# Altium schematic sheet BTS7960.SchDoc
size 420 x 297 mm; SheetNumber: 3; SheetTotal: 4; Organization: Altium Limited; Address1: L3, 12a Rodborough Rd; Address2: Frenchs Forest; Address3: NSW; Address4: Australia 2086
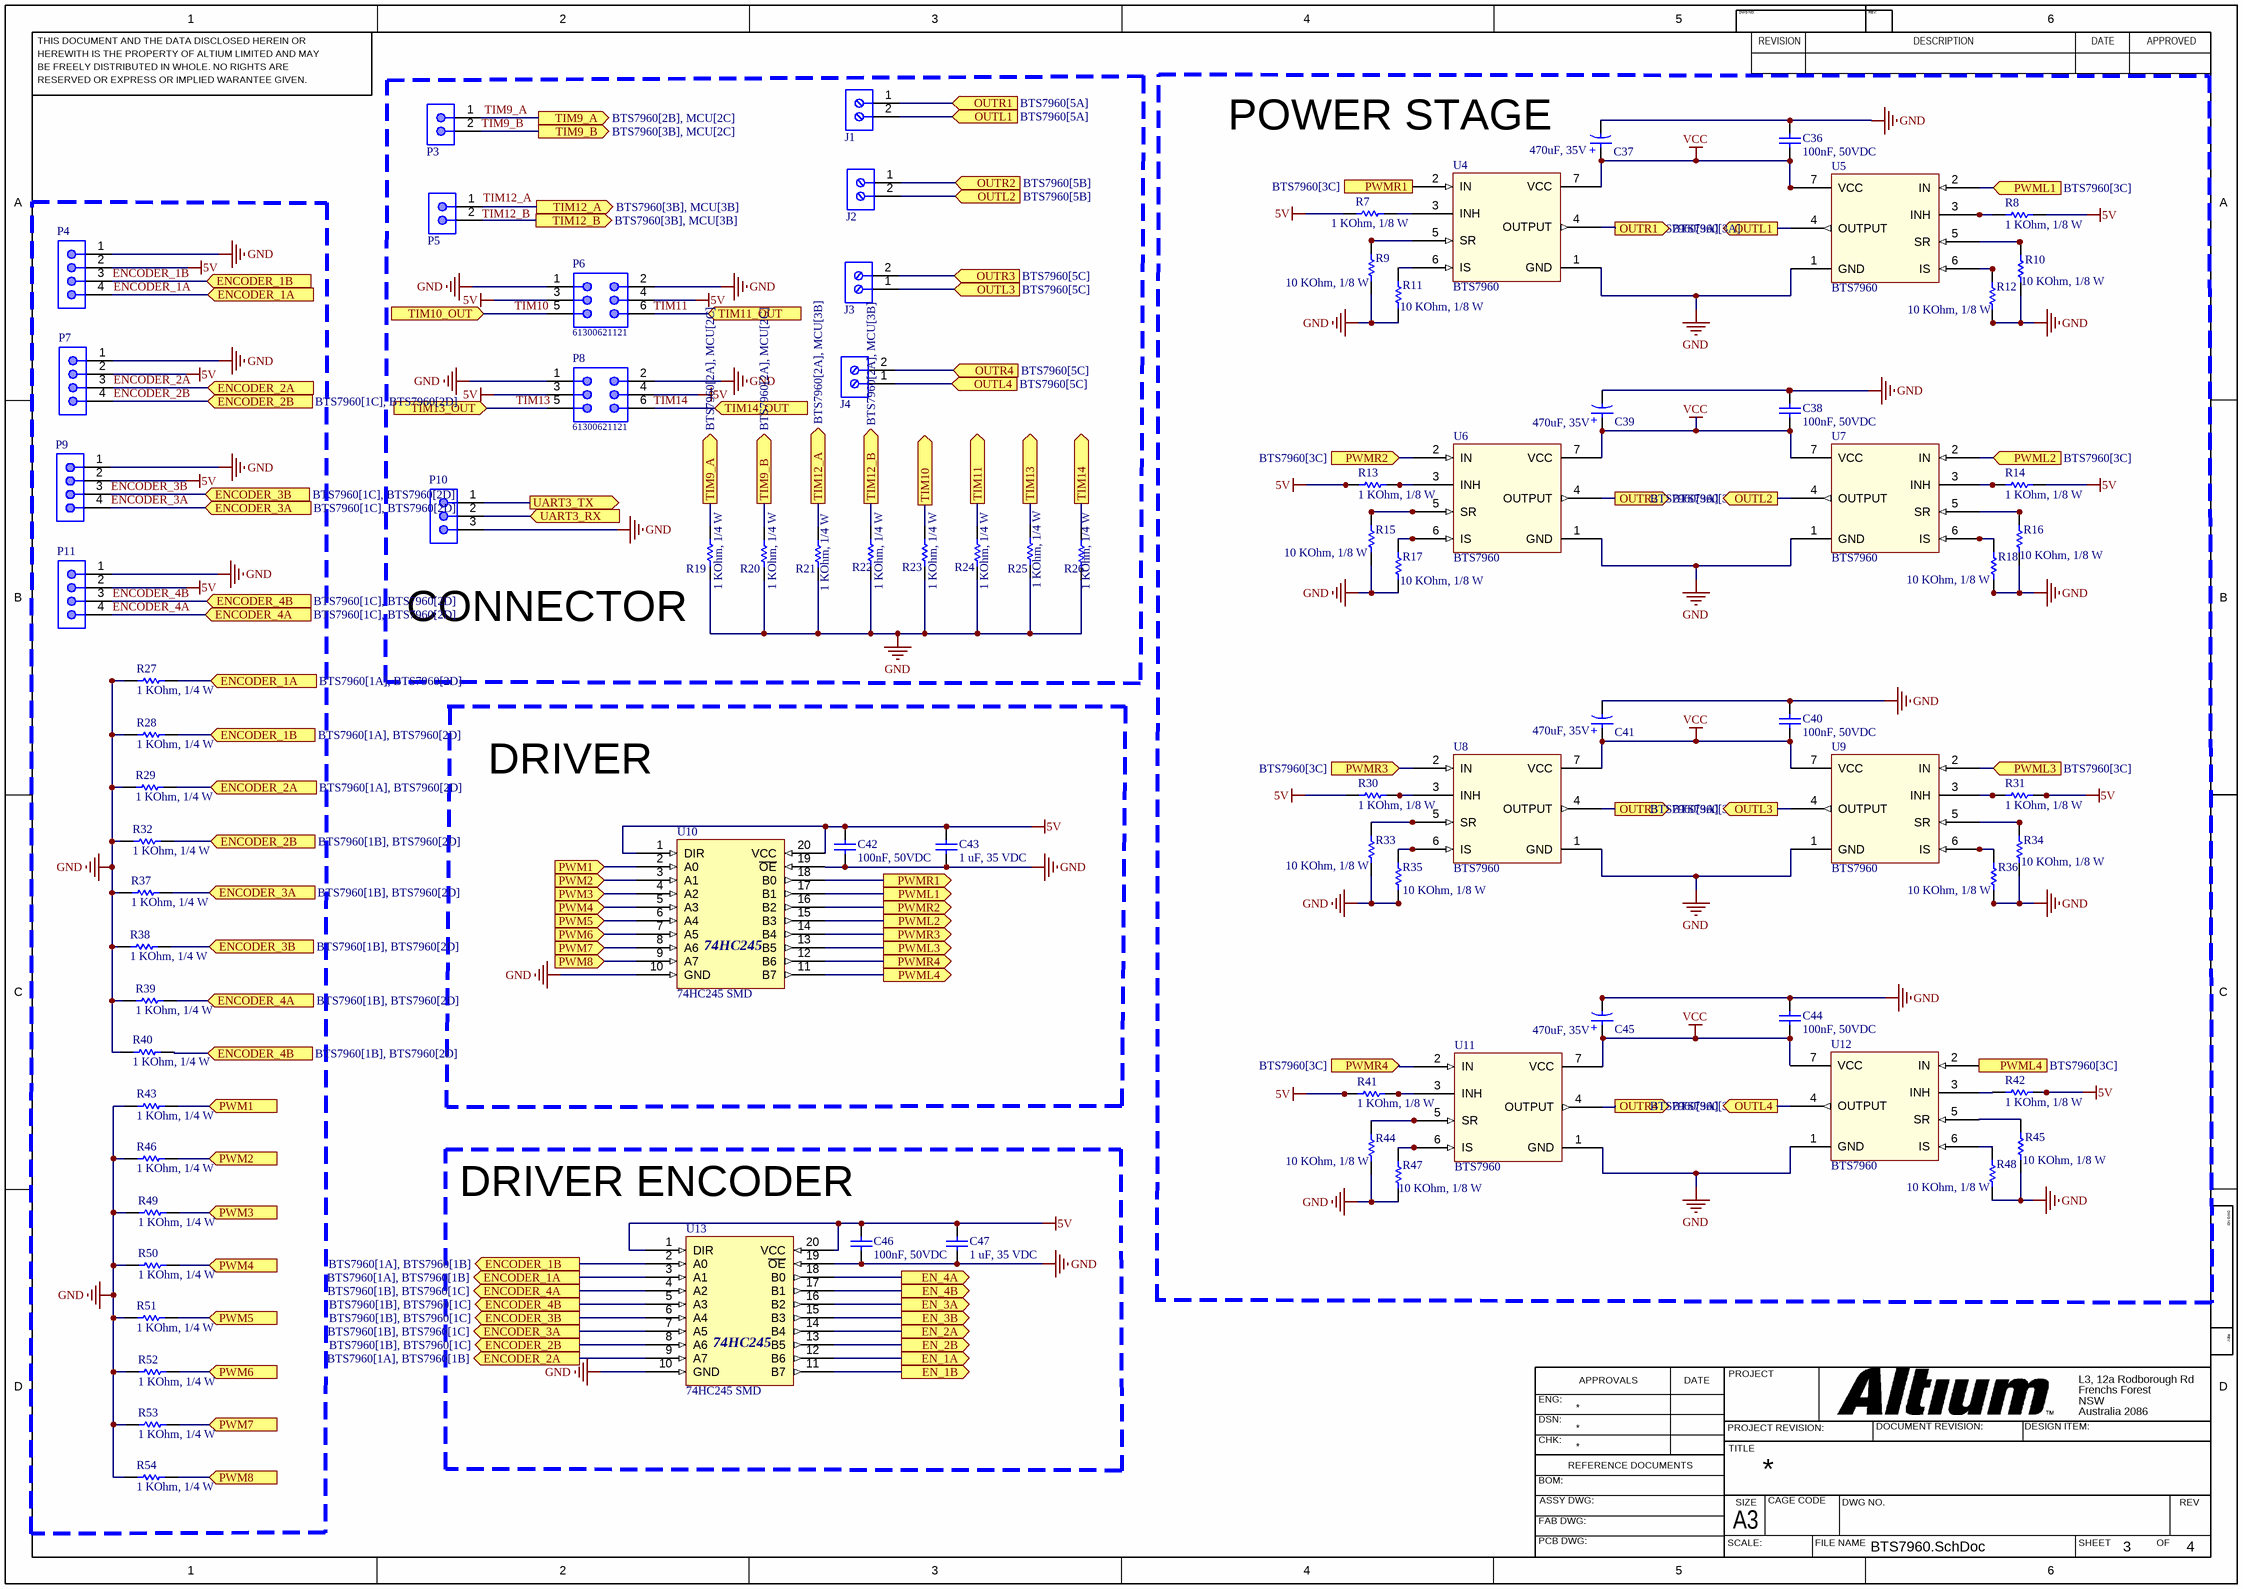
[diagram p0: BTS7960.SchDoc]

## Parts
C36  100nF, 50VDC  [CAP_0805]
C37  470uF, 35V  [WCAP-ASLI_D10H10.5]
C38  100nF, 50VDC  [CAP_0805]
C39  470uF, 35V  [WCAP-ASLI_D10H10.5]
C40  100nF, 50VDC  [CAP_0805]
C41  470uF, 35V  [WCAP-ASLI_D10H10.5]
C42  100nF, 50VDC  [CAP_0805]
C43  1 uF, 35 VDC  [CAP_0805]
C44  100nF, 50VDC  [CAP_0805]
C45  470uF, 35V  [WCAP-ASLI_D10H10.5]
C46  100nF, 50VDC  [CAP_0805]
C47  1 uF, 35 VDC  [CAP_0805]
J1  16A, 300V  [691213710002]  (value not drawn)
J2  16A, 300V  [691213710002]  (value not drawn)
J3  16A, 300V  [691213710002]  (value not drawn)
J4  16A, 300V  [691213710002]  (value not drawn)
P3  2A, 125V(AC)  [62000211622]  (value not drawn)
P4  1A, 50 V (AC)  [64800411622]  (value not drawn)
P5  2A, 125V(AC)  [62000211622]  (value not drawn)
P6  61300621121  [61300621121]
P7  1A, 50 V (AC)  [64800411622]  (value not drawn)
P8  61300621121  [61300621121]
P9  1A, 50 V (AC)  [64800411622]  (value not drawn)
P10  2A, 125V(AC)  [62000311622]  (value not drawn)
P11  1A, 50 V (AC)  [64800411622]  (value not drawn)
R7  1 KOhm, 1/8 W  [RESISTOR_0805]
R8  1 KOhm, 1/8 W  [RESISTOR_0805]
R9  10 KOhm, 1/8 W  [RESISTOR_0805]
R10  10 KOhm, 1/8 W  [RESISTOR_0805]
R11  10 KOhm, 1/8 W  [RESISTOR_0805]
R12  10 KOhm, 1/8 W  [RESISTOR_0805]
R13  1 KOhm, 1/8 W  [RESISTOR_0805]
R14  1 KOhm, 1/8 W  [RESISTOR_0805]
R15  10 KOhm, 1/8 W  [RESISTOR_0805]
R16  10 KOhm, 1/8 W  [RESISTOR_0805]
R17  10 KOhm, 1/8 W  [RESISTOR_0805]
R18  10 KOhm, 1/8 W  [RESISTOR_0805]
R19  1 KOhm, 1/4 W  [resistor_0603]
R20  1 KOhm, 1/4 W  [resistor_0603]
R21  1 KOhm, 1/4 W  [resistor_0603]
R22  1 KOhm, 1/4 W  [resistor_0603]
R23  1 KOhm, 1/4 W  [resistor_0603]
R24  1 KOhm, 1/4 W  [resistor_0603]
R25  1 KOhm, 1/4 W  [resistor_0603]
R26  1 KOhm, 1/4 W  [resistor_0603]
R27  1 KOhm, 1/4 W  [resistor_0603]
R28  1 KOhm, 1/4 W  [resistor_0603]
R29  1 KOhm, 1/4 W  [resistor_0603]
R30  1 KOhm, 1/8 W  [RESISTOR_0805]
R31  1 KOhm, 1/8 W  [RESISTOR_0805]
R32  1 KOhm, 1/4 W  [resistor_0603]
R33  10 KOhm, 1/8 W  [RESISTOR_0805]
R34  10 KOhm, 1/8 W  [RESISTOR_0805]
R35  10 KOhm, 1/8 W  [RESISTOR_0805]
R36  10 KOhm, 1/8 W  [RESISTOR_0805]
R37  1 KOhm, 1/4 W  [resistor_0603]
R38  1 KOhm, 1/4 W  [resistor_0603]
R39  1 KOhm, 1/4 W  [resistor_0603]
R40  1 KOhm, 1/4 W  [resistor_0603]
R41  1 KOhm, 1/8 W  [RESISTOR_0805]
R42  1 KOhm, 1/8 W  [RESISTOR_0805]
R43  1 KOhm, 1/4 W  [resistor_0603]
R44  10 KOhm, 1/8 W  [RESISTOR_0805]
R45  10 KOhm, 1/8 W  [RESISTOR_0805]
R46  1 KOhm, 1/4 W  [resistor_0603]
R47  10 KOhm, 1/8 W  [RESISTOR_0805]
R48  10 KOhm, 1/8 W  [RESISTOR_0805]
R49  1 KOhm, 1/4 W  [resistor_0603]
R50  1 KOhm, 1/4 W  [resistor_0603]
R51  1 KOhm, 1/4 W  [resistor_0603]
R52  1 KOhm, 1/4 W  [resistor_0603]
R53  1 KOhm, 1/4 W  [resistor_0603]
R54  1 KOhm, 1/4 W  [resistor_0603]
U4  BTS7960  [INF-P-TO-263-7-6_M]
U5  BTS7960  [INF-P-TO-263-7-6_M]
U6  BTS7960  [INF-P-TO-263-7-6_M]
U7  BTS7960  [INF-P-TO-263-7-6_M]
U8  BTS7960  [INF-P-TO-263-7-6_M]
U9  BTS7960  [INF-P-TO-263-7-6_M]
U10  74HC245 SMD  [DW0020A_L]
U11  BTS7960  [INF-P-TO-263-7-6_M]
U12  BTS7960  [INF-P-TO-263-7-6_M]
U13  74HC245 SMD  [DW0020A_L]

## Blocks framed on the sheet
CONNECTOR: J1-J4 P3 P5 P6 P8 P10 R19-R26
POWER STAGE: C36-C41 C44 C45 R7-R18 R30 R31 R33-R36 R41 R42 R44 R45 R47 R48 U4-U9 U11 U12
DRIVER ENCODER: C46 C47 U13

## Ports
EN_1A (out, see MCU[2C]), EN_1B (out, see MCU[2C]), EN_2A (out, see MCU[3A]), EN_2B (out, see MCU[3A]), EN_3A (out, see MCU[2A]), EN_3B (out, see MCU[3A]), EN_4A (out, see MCU[2A]), EN_4B (out, see MCU[2A]), ENCODER_1A (in, see BTS7960[1A], BTS7960[2D]), ENCODER_1A (in, see BTS7960[1B], BTS7960[2D]), ENCODER_1A (out, see BTS7960[1A], BTS7960[1B]), ENCODER_1B (in, see BTS7960[1A], BTS7960[2D]), ENCODER_1B (in, see BTS7960[1B], BTS7960[2D]), ENCODER_1B (out, see BTS7960[1A], BTS7960[1B]), ENCODER_2A (in, see BTS7960[1A], BTS7960[2D]), ENCODER_2A (in, see BTS7960[1B], BTS7960[2D]), ENCODER_2A (out, see BTS7960[1A], BTS7960[1B]), ENCODER_2B (in, see BTS7960[1B], BTS7960[2D]), ENCODER_2B (in, see BTS7960[1C], BTS7960[2D]), ENCODER_2B (out, see BTS7960[1B], BTS7960[1C]), ENCODER_3A (in, see BTS7960[1B], BTS7960[2D]), ENCODER_3A (in, see BTS7960[1C], BTS7960[2D]), ENCODER_3A (out, see BTS7960[1B], BTS7960[1C]), ENCODER_3B (in, see BTS7960[1B], BTS7960[2D]), ENCODER_3B (in, see BTS7960[1C], BTS7960[2D]), ENCODER_3B (out, see BTS7960[1B], BTS7960[1C]), ENCODER_4A (in, see BTS7960[1B], BTS7960[2D]), ENCODER_4A (in, see BTS7960[1C], BTS7960[2D]), ENCODER_4A (out, see BTS7960[1B], BTS7960[1C]), ENCODER_4B (in, see BTS7960[1B], BTS7960[2D]), ENCODER_4B (in, see BTS7960[1C], BTS7960[2D]), ENCODER_4B (out, see BTS7960[1B], BTS7960[1C]), OUTL1 (in, see BTS7960[5A]), OUTL1 (out, see BTS7960[3A]), OUTL2 (in, see BTS7960[5B]), OUTL2 (out, see BTS7960[3A]), OUTL3 (in, see BTS7960[5C]), OUTL3 (out, see BTS7960[3A]), OUTL4 (in, see BTS7960[5C]), OUTL4 (out, see BTS7960[3A]), OUTR1 (in, see BTS7960[5A]), OUTR1 (out, see BTS7960[3A]), OUTR2 (in, see BTS7960[5B]), OUTR2 (out, see BTS7960[3A]), OUTR3 (in, see BTS7960[5C]), OUTR3 (out, see BTS7960[3A]), OUTR4 (in, see BTS7960[5C]), OUTR4 (out, see BTS7960[3A]), PWM1 (in, see BTS7960[1C], MCU[2B]), PWM1 (in, see BTS7960[2C], MCU[2B]), PWM2 (in, see BTS7960[1C], MCU[2B]), PWM2 (in, see BTS7960[2C], MCU[2B]), PWM3 (in, see BTS7960[1D], MCU[2B]), PWM3 (in, see BTS7960[2C], MCU[2B]), PWM4 (in, see BTS7960[1D], MCU[2B]), PWM4 (in, see BTS7960[2C], MCU[2B]), PWM5 (in, see BTS7960[1D], MCU[3B]), PWM5 (in, see BTS7960[2C], MCU[3B]), PWM6 (in, see BTS7960[1D], MCU[3B]), PWM6 (in, see BTS7960[2C], MCU[3B]), PWM7 (in, see BTS7960[1D], MCU[3B]), PWM7 (in, see BTS7960[2C], MCU[3B]), PWM8 (in, see BTS7960[1D], MCU[3B]), PWM8 (in, see BTS7960[2C], MCU[3B]), PWML1 (in, see BTS7960[3C]), PWML1 (out, see BTS7960[6A]), PWML2 (in, see BTS7960[3C]), PWML2 (out, see BTS7960[6B]), PWML3 (in, see BTS7960[3C]), PWML3 (out, see BTS7960[6B]), PWML4 (in, see BTS7960[3C]), PWML4 (out, see BTS7960[6C]), PWMR1 (in, see BTS7960[3C]), PWMR1 (out, see BTS7960[4A]), PWMR2 (in, see BTS7960[3C]), PWMR2 (out, see BTS7960[4B]), PWMR3 (in, see BTS7960[3C]), PWMR3 (out, see BTS7960[4B]), PWMR4 (in, see BTS7960[3C]), PWMR4 (out, see BTS7960[4C]), TIM9_A (out, see BTS7960[2A], MCU[2C]), TIM9_A (out, see BTS7960[2B], MCU[2C]), TIM9_B (out, see BTS7960[2A], MCU[2C]), TIM9_B (out, see BTS7960[3B], MCU[2C]), TIM10 (out, see Controller[4C], MCU[3B]), TIM10_OUT (in, see Controller[5C]), TIM11 (out, see Controller[5C], MCU[3B]), TIM11_OUT (in, see Controller[6C]), TIM12_A (out, see BTS7960[2A], MCU[3B]), TIM12_A (out, see BTS7960[3B], MCU[3B]), TIM12_B (out, see BTS7960[2A], MCU[3B]), TIM12_B (out, see BTS7960[3B], MCU[3B]), TIM13 (out, see Controller[4C], MCU[2B]), TIM13_OUT (in, see Controller[5C]), TIM14 (out, see Controller[5C], MCU[2B]), TIM14_OUT (in, see Controller[6C]), UART3_RX (in, see MCU[3B]), UART3_TX (out, see MCU[3B])

## Nets
5V: C42.2 C43.2 C46.2 C47.2 P4.2 P6.3 P6.4 P7.2 P8.3 P8.4 P9.2 P11.2 R7.1 R8.2 R13.1 R14.2 R30.1 R31.2 R41.1 R42.2 U10.1(DIR) U10.20(VCC) U13.1(DIR) U13.20(VCC)
GND: C36.2 C37.2(N) C38.2 C39.2(N) C40.2 C41.2(N) C42.1 C43.1 C44.2 C45.2(N) C46.1 C47.1 P4.1 P6.1 P6.2 P7.1 P8.1 P8.2 P9.1 P10.3 P11.1 R9.1 R10.1 R11.1 R12.1 R15.1 R16.1 R17.1 R18.1 R19.1 R20.1 R21.1 R22.1 R23.1 R24.1 R25.1 R26.1 R27.2 R28.2 R29.2 R32.2 R33.1 R34.1 R35.1 R36.1 R37.2 R38.2 R39.2 R40.2 R43.2 R44.1 R45.1 R46.2 R47.1 R48.1 R49.2 R50.2 R51.2 R52.2 R53.2 R54.2 U4.1(GND) U5.1(GND) U6.1(GND) U7.1(GND) U8.1(GND) U9.1(GND) U10.10(GND) U10.19(~{OE}) U11.1(GND) U12.1(GND) U13.10(GND) U13.19(~{OE})
VCC: C36.1 C37.1(P) C38.1 C39.1(P) C40.1 C41.1(P) C44.1 C45.1(P) U4.7(VCC) U5.7(VCC) U6.7(VCC) U7.7(VCC) U8.7(VCC) U9.7(VCC) U11.7(VCC) U12.7(VCC)
EN_1A: U13.12(B6) ; port EN_1A
EN_1B: U13.11(B7) ; port EN_1B
EN_2A: U13.14(B4) ; port EN_2A
EN_2B: U13.13(B5) ; port EN_2B
EN_3A: U13.16(B2) ; port EN_3A
EN_3B: U13.15(B3) ; port EN_3B
EN_4A: U13.18(B0) ; port EN_4A
EN_4B: U13.17(B1) ; port EN_4B
ENCODER_1A: P4.4 R27.1 U13.3(A1) ; port ENCODER_1A
ENCODER_1B: P4.3 R28.1 U13.2(A0) ; port ENCODER_1B
ENCODER_2A: P7.3 R29.1 U13.9(A7) ; port ENCODER_2A
ENCODER_2B: P7.4 R32.1 U13.8(A6) ; port ENCODER_2B
ENCODER_3A: P9.4 R37.1 U13.7(A5) ; port ENCODER_3A
ENCODER_3B: P9.3 R38.1 U13.6(A4) ; port ENCODER_3B
ENCODER_4A: P11.4 R39.1 U13.4(A2) ; port ENCODER_4A
ENCODER_4B: P11.3 R40.1 U13.5(A3) ; port ENCODER_4B
OUTL1: J1.2 U5.4(OUTPUT) ; port OUTL1
OUTL2: J2.2 U7.4(OUTPUT) ; port OUTL2
OUTL3: J3.1 U9.4(OUTPUT) ; port OUTL3
OUTL4: J4.1 U12.4(OUTPUT) ; port OUTL4
OUTR1: J1.1 U4.4(OUTPUT) ; port OUTR1
OUTR2: J2.1 U6.4(OUTPUT) ; port OUTR2
OUTR3: J3.2 U8.4(OUTPUT) ; port OUTR3
OUTR4: J4.2 U11.4(OUTPUT) ; port OUTR4
PWM1: R43.1 U10.2(A0) ; port PWM1
PWM2: R46.1 U10.3(A1) ; port PWM2
PWM3: R49.1 U10.4(A2) ; port PWM3
PWM4: R50.1 U10.5(A3) ; port PWM4
PWM5: R51.1 U10.6(A4) ; port PWM5
PWM6: R52.1 U10.7(A5) ; port PWM6
PWM7: R53.1 U10.8(A6) ; port PWM7
PWM8: R54.1 U10.9(A7) ; port PWM8
PWML1: U5.2(IN) U10.17(B1) ; port PWML1
PWML2: U7.2(IN) U10.15(B3) ; port PWML2
PWML3: U9.2(IN) U10.13(B5) ; port PWML3
PWML4: U10.11(B7) U12.2(IN) ; port PWML4
PWMR1: U4.2(IN) U10.18(B0) ; port PWMR1
PWMR2: U6.2(IN) U10.16(B2) ; port PWMR2
PWMR3: U8.2(IN) U10.14(B4) ; port PWMR3
PWMR4: U10.12(B6) U11.2(IN) ; port PWMR4
TIM9_A: P3.1 R19.2 ; port TIM9_A
TIM9_B: P3.2 R20.2 ; port TIM9_B
TIM10: P6.5 ; port TIM10_OUT
TIM10: R23.2 ; port TIM10  [a separate net that carries the same name]
TIM11: R24.2 ; port TIM11
TIM11_OUT: P6.6 ; port TIM11_OUT
TIM12_A: P5.1 R21.2 ; port TIM12_A
TIM12_B: P5.2 R22.2 ; port TIM12_B
TIM13: P8.5 ; port TIM13_OUT
TIM13: R25.2 ; port TIM13  [a separate net that carries the same name]
TIM14: R26.2 ; port TIM14
TIM14_OUT: P8.6 ; port TIM14_OUT
UART3_RX: P10.2 ; port UART3_RX
UART3_TX: P10.1 ; port UART3_TX
NetR7_2: R7.2 U4.3(INH)
NetR8_1: R8.1 U5.3(INH)
NetR9_2: R9.2 U4.5(SR)
NetR10_2: R10.2 U5.5(SR)
NetR11_2: R11.2 U4.6(IS)
NetR12_2: R12.2 U5.6(IS)
NetR13_2: R13.2 U6.3(INH)
NetR14_1: R14.1 U7.3(INH)
NetR15_2: R15.2 U6.5(SR)
NetR16_2: R16.2 U7.5(SR)
NetR17_2: R17.2 U6.6(IS)
NetR18_2: R18.2 U7.6(IS)
NetR30_2: R30.2 U8.3(INH)
NetR31_1: R31.1 U9.3(INH)
NetR33_2: R33.2 U8.5(SR)
NetR34_2: R34.2 U9.5(SR)
NetR35_2: R35.2 U8.6(IS)
NetR36_2: R36.2 U9.6(IS)
NetR41_2: R41.2 U11.3(INH)
NetR42_1: R42.1 U12.3(INH)
NetR44_2: R44.2 U11.5(SR)
NetR45_2: R45.2 U12.5(SR)
NetR47_2: R47.2 U11.6(IS)
NetR48_2: R48.2 U12.6(IS)

## Notes on the sheet
- DRIVER
- Labels drawn without touching a wire or pin: TIM11, TIM12_A, TIM12_B, TIM14
- THIS DOCUMENT AND THE DATA DISCLOSED HEREIN OR
- HEREWITH IS THE PROPERTY OF ALTIUM LIMITED AND MAY
- DWG NO:
- REVISION
- REV:
- DESCRIPTION
- DATE
- APPROVED
- BE FREELY DISTRIBUTED IN WHOLE. NO RIGHTS ARE
- RESERVED OR EXPRESS OR IMPLIED WARANTEE GIVEN.
- ENG:
- APPROVALS
- PROJECT
- DSN:
- CHK:
- REFERENCE DOCUMENTS
- PROJECT REVISION:
- TITLE
- DOCUMENT REVISION:
- DESIGN ITEM:
- BOM:
- FAB DWG:
- PCB DWG:
- ASSY DWG:
- SCALE:
- A3
- SIZE
- CAGE CODE
- FILE NAME
- DWG NO.
- SHEET
- OF
- REV
- (in symbol 74HC245 SMD) 74HC245
- (in symbol 865080457015) +

## Library data of the parts
C36 C38 C40 C42 C44 C46 = 0108051541050: CAP, size 0805, 150 nF, 50 VDC; Manufacture Name: TDK; Manufacture SN: CGA4J2X7R1H154K125AD; Capacitance: 150 nF; Tolerance: +/-10%; ComponentLink2Description: Datasheet; ComponentLink2URL: https://product.tdk.com/system/files/dam/doc/product/capacitor/ceramic/mlcc/catalog/mlcc_automotive_epoxy_en.pdf?ref_disty=mouser; Operating Temperature: -55 to +125degC; Packaging: Tape and Reel; Mounting Technology: SMT; Size: 0805; Supplier 1 Name: Mouser; Supplier 1 SN: 810-CGA4J2X7R1H154KD; Supplier 1 URL: https://www.mouser.vn/ProductDetail/TDK/CGA4J2X7R1H154K125AD?qs=xLDY6iXSiQYlxmVq9lRXDA%3D%3D&utm_source=mouser-refine-download&utm_medium=file&utm_campaign=CGA4J2X7R1H154K125AD&utm_content=TDK; Supplier 2 Name: Digi-Key; Supplier 2 SN: 445-9929-2-ND; Supplier 2 URL: https://www.digikey.com/en/products/detail/tdk-corporation/cga4j2x7r1h154k125ad/3933662; Supplier 3 Name: thegioiic; Supplier 3 SN: OEM; Supplier 3 URL: N/A; Voltage Rating DC: 50 VDC; Value: 150 nF, 50 VDC
C37 C39 C41 C45 = 865080457015: V-Chip, D10 x H10.5mm, 470uF, 25V; Manufacturer: Wurth Elektronik; Capacitance Tolerance: +/-20%; Dissipation Factor: 14%; Endurance: 2000h; Leakage Current: 117.5uA; Ripple Current: 650mA; Category: Aluminum Electrolytic Capacitors; ComponentLink2Description: Datasheet Link; ComponentLink2URL: https://www.we-online.com/redexpert/spec/865080457015?ad; Mount: Surface Mount; Operating Temperature Max: 105°C; Operating Temperature Min: -55°C; Packaging: Tape and Reel; Height: 10.5mm; Diameter: 10mm; Capacitance: 470uF; Rated Voltage (DC): 25V; Supplier 1 Name: Mouser; Supplier 1 SN: 710-865080457015; Supplier 3 URL: https://www.thegioiic.com/tu-nhom-smd-470uf-25v-10x10-5mm; Supplier 3 Name: thegioiic; Supplier 1 URL: https://www.mouser.com/ProductDetail/Wurth-Elektronik/865080457015?qs=0KOYDY2FL2%252BEKTJa1jxjAQ%3D%3D; Manufacturer Part Number: N/A; Supplier 2 Name: Digi-Key; Supplier 2 SN: N/A; Supplier 2 URL: N/A; Supplier 3 SN: N/A; Value: 470uF, 25V
C43 C47 = 0108051051035: CAP, size 0805, 1 uF, 35 VDC; Manufacture Name: TDK; Manufacture SN: CGA4J3X7R1V105K125AE; Capacitance: 1 uF; Tolerance: +/-10%; Voltage Rating DC: 35 VDC; ComponentLink2Description: Datasheet; ComponentLink2URL: https://product.tdk.com/system/files/dam/doc/product/capacitor/ceramic/mlcc/catalog/mlcc_automotive_soft_en.pdf?ref_disty=mouser; Operating Temperature: -55 to +125degC; Packaging: Tape and Reel; Mounting Technology: SMT; Size: 0805; Supplier 1 Name: Mouser; Supplier 1 SN: 810-CGA4J3X7R1V105KA; Supplier 1 URL: https://www.mouser.vn/ProductDetail/TDK/CGA4J3X7R1V105K125AE?qs=nQSIdc08i%252BeiqBo2hW7QzQ%3D%3D&utm_source=mouser-refine-download&utm_medium=file&utm_campaign=CGA4J3X7R1V105K125AE&utm_content=TDK; Supplier 2 Name: Digi-Key; Supplier 2 SN: 445-173710-2-ND; Supplier 2 URL: https://www.digikey.com/en/products/detail/tdk-corporation/cga4j3x7r1v105k125ae/5809275; Supplier 3 Name: thegioiic; Supplier 3 SN: OEM; Supplier 3 URL: N/A; Value: 1 uF, 35 VDC
J1-J4 = 691213710002: WR-TBL Series 213 Horizontal Entry Modular, THT, pitch 5mm, 2p; Manufacturer: Wurth Elektronik; Modularity: Yes; Rated Current: 10A; ComponentLink1Description: Datasheet Link; ComponentLink1URL: https://www.we-online.com/redexpert/spec/691213710002?ad; ComponentLink2Description: Supplier 1 URL; ComponentLink2URL: N/A; Manufacturer Part Number: 691213710002; Category: Terminal Blocks; Match Code: WR-TBL; Mount: Through Hole; Operating Temperature Max: 105°C; Operating Temperature Min: -40°C; Packaging: Box; Application: Rising Cage Clamp; Number of Pins: 2; Number of Rows: 1; Orientation: Horizontal; Pitch: 5mm; Working Voltage: 300V; ComponentLink3Description: Supplier 2 URL; ComponentLink3URL: N/A; ComponentLink4Description: Supplier 3 URL; ComponentLink4URL: https://www.thegioiic.com/kf128-2-v-domino-2-chan-thang-5mm-300v-10a-han-pcb-loai-tot; Supplier 1 Name: Mouser; Supplier 1 SN: N/A; Supplier 1 URL: N/A; Supplier 2 Name: Digi-Key; Supplier 2 SN: N/A; Supplier 2 URL: N/A; Supplier 3 Name: thegioiic; Supplier 3 SN: N/A; Supplier 3 URL: https://www.thegioiic.com/kf128-2-v-domino-2-chan-thang-5mm-300v-10a-han-pcb-loai-tot; Value: 16A, 300V
P3 P5 = 62000211622: WR-WTB Male Vertical Shrouded Header, pitch 2mm, 2p; Pin Number: 2; Contact Resistance: 20mOhm; Withstanding Voltage: 800VAC; Working Voltage: 125VAC; ComponentLink1Description: Manufacturer; ComponentLink1URL: http://www.we-online.de; ComponentLink2Description: Datasheet; ComponentLink2URL: https://www.we-online.com/catalog/datasheet/62000211622.pdf; Pitch: 2mm; Published Date: January 2020; Publisher: Wurth Elektronik; Mounting Technology: THT; Packaging: Bag; Operating Temperature: -25 to +85degC; Part Number: 62000211622; Gender: Male; Type: Vertical; Rated Current: 2A; ComponentLink3Description: Global Supply; ComponentLink3URL: https://www.we-online.com/en/components/products/WTB_2_00_MALE_VERTICAL_SHROUDED_HEADER_6200XX11622?sq=62000211622#62000211622; ComponentLink4Description: Global Supply; ComponentLink4URL: https://www.mouser.vn/ProductDetail/Wurth-Elektronik/62000211622?qs=ulEaXIWI0c90wrFEMj4Fiw%3D%3D; Supplier 1 Name: Mouser; Supplier 1 SN: 710-62000211622; Supplier 1 URL: https://www.mouser.vn/ProductDetail/Wurth-Elektronik/62000211622?qs=ulEaXIWI0c90wrFEMj4Fiw%3D%3D; Supplier 2 Name: Digi-Key; Supplier 2 SN: N/A; Supplier 2 URL: N/A; Supplier 3 Name: thegioiic; Supplier 3 SN: N/A; Supplier 3 URL: N/A; Value: 2A, 125V(AC)
P4 P7 P9 P11 = 64800411622: WR-WTB THT Male Vertical Shrouded Header, pitch 1.5mm, 4p; Pin Number: 4; Contact Resistance: 20mOhm; Withstanding Voltage: 500VAC; Working Voltage: 50VAC; ComponentLink1Description: Manufacturer; ComponentLink1URL: http://www.we-online.de; ComponentLink2Description: Datasheet; ComponentLink2URL: https://www.we-online.com/catalog/datasheet/64800411622.pdf; Pitch: 1.5mm; Published Date: January 2020; Publisher: Wurth Elektronik; Mounting Technology: THT; Packaging: Bag; Operating Temperature: -25 to +85degC; Part Number: 64800411622; Gender: Male; Type: Vertical; Rated Current: 1A; ComponentLink3Description: Global Supply; ComponentLink3URL: https://www.we-online.com/en/components/products/WTB_1_50_MALE_VERTICAL_SHROUDED_HEADER_6480XX11622?sq=64800411622#64800411622; Supplier 1 Name: Mouser; Supplier 1 SN: N/A; Supplier 1 URL: N/A; Supplier 2 Name: Digi-Key; Supplier 2 SN: N/A; Supplier 2 URL: N/A; Supplier 3 Name: thegioiic; Supplier 3 SN: N/A; Supplier 3 URL: N/A; Value: 1A, 50 V (AC)
P6 P8 = 61300621121: WR-PHD Pin Header, THT, pitch 2.54mm, Dual Row, Vertical, 6p; Manufacturer: Wurth Elektronik; Pin Number: 6; Rated Current: 3A; Working Voltage: 250VAC; Withstanding Voltage: 500VAC; Contact Resistance: 20mOhm; Supply name 1: Mouser; ComponentLink1Description: Manufacturer; ComponentLink1URL: http://www.we-online.de; ComponentLink2Description: Datasheet; ComponentLink2URL: https://www.we-online.com/catalog/datasheet/61300621121.pdf; Manufacturer Part Number: 61300621121; Published Date: May 2020; Pitch: 2.54mm; Operating Temperature: -40 to +105degC; Mounting Technology: THT; Packaging: Bag; Gender: Pin Header; Row Number: Dual; Orientation: Vertical; ComponentLink3Description: Global Supply; ComponentLink3URL: https://www.we-online.com/en/components/products/PHD_2_54_THT_DUAL_PIN_HEADER_6130XX21121?sq=61300621121#61300621121; ComponentLink4Description: Global Supply; ComponentLink4URL: https://www.mouser.vn/ProductDetail/Wurth-Elektronik/61300621121?qs=PhR8RmCirEb94hrEcn0AQg%3D%3D; Supplier 1 Name: Mouser; Supplier 1 SN: 710-61300621121; Supplier 1 URL: https://www.mouser.vn/ProductDetail/Wurth-Elektronik/61300621121?qs=PhR8RmCirEb94hrEcn0AQg%3D%3D; Supplier 2 Name: Digi-Key; Supplier 2 SN: N/A; Supplier 2 URL: N/A; Supplier 3 Name: thegioiic; Supplier 3 SN: N/A; Supplier 3 URL: N/A
P10 = 62000311622: WR-WTB Male Vertical Shrouded Header, pitch 2mm, 3p; Pin Number: 3; Contact Resistance: 20mOhm; Withstanding Voltage: 800VAC; Working Voltage: 125VAC; ComponentLink1Description: Manufacturer; ComponentLink1URL: http://www.we-online.de; ComponentLink2Description: Datasheet; ComponentLink2URL: https://www.we-online.com/catalog/datasheet/62000311622.pdf; Pitch: 2mm; Published Date: January 2020; Publisher: Wurth Elektronik; Mounting Technology: THT; Packaging: Bag; Operating Temperature: -25 to +85degC; Part Number: 62000311622; Gender: Male; Type: Vertical; Rated Current: 2A; ComponentLink3Description: Global Supply; ComponentLink3URL: https://www.we-online.com/en/components/products/WTB_2_00_MALE_VERTICAL_SHROUDED_HEADER_6200XX11622?sq=62000311622#62000311622; Supplier 1 Name: Mouser; Supplier 1 SN: N/A; Supplier 1 URL: N/A; Supplier 2 Name: Digi-Key; Supplier 2 SN: N/A; Supplier 2 URL: N/A; Supplier 3 Name: thegioiic; Supplier 3 SN: N/A; Supplier 3 URL: N/A; Value: 2A, 125V(AC)
R7 R8 R13 R14 R30 R31 R41 R42 = 0008051021: RES, size 0805, 1 KOhm, 1/8 W; Manufacture  Name: Vishay Dale; Manufacture  SN: M55342K06B1E00RS3; Resistance tolerance: +/-1%; Rated Power: 1/8 W; Resistance: 1 KOhm; Size: 0805; Mounting Technology: SMT; Supplier 1 Name: Mouser; Supplier 1 SN: N/A; Supplier 1 URL: N/A; Supplier 2 Name: Digi-Key; Supplier 2 SN: 1135-1001-2-ND; Supplier 2 URL: https://www.digikey.com/en/products/detail/vishay-dale/M55342K06B1E00RS3/2941798; Supplier 3 Name: Thegioiic; Supplier 3 SN: N/A; Supplier 3 URL: https://www.thegioiic.com/dien-tro-1-kohm-0805-1; Value: 1 KOhm, 1/8 W; ComponentLink1Description: Datasheet link; ComponentLink1URL: https://www.vishay.com/docs/31010/rcwpm.pdf; ComponentLink2Description: Supplier 1 URL; ComponentLink2URL: N/A; ComponentLink3Description: Supplier 2 URL; ComponentLink3URL: https://www.digikey.com/en/products/detail/vishay-dale/M55342K06B1E00RS3/2941798; ComponentLink4Description: Supplier 3 URL; ComponentLink4URL: https://www.thegioiic.com/dien-tro-1-kohm-0805-1
R9-R12 = 0008051031: RES, size 0805, 10 KOhm, 1/8 W; Resistance tolerance: +/-1%; Rated Power: 1/8 W; Resistance: 10 KOhm; Size: 0805; Mounting Technology: SMT; Supplier 1 Name: Mouser; Supplier 1 SN: N/A; Supplier 1 URL: N/A; Supplier 2 Name: Digi-Key; Supplier 2 SN: N/A; Supplier 2 URL: N/A; Supplier 3 Name: Thegioiic; Supplier 3 SN: N/A; Supplier 3 URL: https://www.thegioiic.com/dien-tro-1-kohm-0805-1; Manufacture  Name: N/A; Manufacture  SN: N/A; Value: 10 KOhm, 1/8 W; ComponentLink1Description: Datasheet link; ComponentLink1URL: N/A; ComponentLink2Description: Supplier 1 URL; ComponentLink2URL: N/A; ComponentLink3Description: Supplier 2 URL; ComponentLink3URL: N/A; ComponentLink4Description: Supplier 3 URL; ComponentLink4URL: https://www.thegioiic.com/dien-tro-1-kohm-0805-1
R15-R18 R33-R36 R44 R45 R47 R48 = 0008051035: RES, size 0805, 10 KOhm, 1/8 W; Manufacture  Name: Vishay Dale; Manufacture  SN: CRCW080510K0JNEAC; Resistance tolerance: +/-5%; Rated Power: 1/8 W; Resistance: 10 KOhm; Size: 0805; Mounting Technology: SMT; Supplier 1 Name: Mouser; Supplier 1 SN: 71-CRCW080510K0JNEB; Supplier 1 URL: https://www.mouser.vn/ProductDetail/Vishay-Dale/CRCW080510K0JNEB?qs=LOX6nxTstiZ5fn9YUdHx5A%3D%3D; Supplier 2 Name: Digi-Key; Supplier 2 SN: 541-4163-2-ND; Supplier 2 URL: https://www.digikey.com/en/products/detail/vishay-dale/CRCW080510K0JNEAC/7928585; Supplier 3 Name: Thegioiic; Supplier 3 SN: N/A; Supplier 3 URL: N/A; Value: 10 KOhm, 1/8 W; ComponentLink1Description: Datasheet link; ComponentLink1URL: https://www.vishay.com/docs/28773/crcwce3.pdf; ComponentLink2Description: Supplier 1 URL; ComponentLink2URL: https://www.mouser.vn/ProductDetail/Vishay-Dale/CRCW080510K0JNEB?qs=LOX6nxTstiZ5fn9YUdHx5A%3D%3D; ComponentLink3Description: Supplier 2 URL; ComponentLink3URL: https://www.digikey.com/en/products/detail/vishay-dale/CRCW080510K0JNEAC/7928585; ComponentLink4Description: Supplier 3 URL; ComponentLink4URL: N/A
R19-R29 R32 R37-R40 R43 R46 R49-R54 = 0006031025: RES, size 0603, 1 KOhm, 1/4 W; Manufacture  Name: Panasonic; Manufacture  SN: ERJ-UP3J102V; Rated Power: 1/4 W; Resistance: 1 KOhm; Resistance Tolerance: +/-5%; Size: 0603; Mounting Technology: SMT; Supplier 1 Name: Mouser; Supplier 1 SN: 667-ERJ-UP3J102V; Supplier 1 URL: https://www.mouser.vn/ProductDetail/Panasonic/ERJ-UP3J102V?qs=GedFDFLaBXG0ASpYP%252B3phQ%3D%3D; Supplier 2 Name: Digi-Key; Supplier 2 SN: 667-ERJ-UP3J102V; Supplier 3 Name: thegioiic; Supplier 3 SN: N/A; Supplier 3 URL: N/A; Value: 1 KOhm, 1/4 W; ComponentLink1Description: Datasheet link; ComponentLink1URL: https://www.mouser.vn/datasheet/2/315/Panasonic_Resistors_Thick_Film_Anti_Sulf_Anti_Surg-1825099.pdf; ComponentLink2Description: Supplier 1 URL; ComponentLink2URL: N/A; ComponentLink3Description: Supplier 2 URL; ComponentLink3URL: https://www.mouser.vn/ProductDetail/Panasonic/ERJ-UP3J102V?qs=GedFDFLaBXG0ASpYP%252B3phQ%3D%3D; ComponentLink4Description: Supplier 3 URL; ComponentLink4URL: N/A; Supplier 2 URL: https://www.mouser.vn/ProductDetail/Panasonic/ERJ-UP3J102V?qs=GedFDFLaBXG0ASpYP%252B3phQ%3D%3D
U10 U13 = 74HC245 SMD: Dán; Ten_Linh_Kien: 74HC245DW SSOP20 5.2MM; Don_Vi: Con; Ma_Hang: MH003571; Ghi_Chu: *; Kieu_Chan: *; Chung_Loai: Dán